# Altium schematic sheet Sheet1.SchDoc
size A3; SheetNumber: 1; SheetTotal: 1
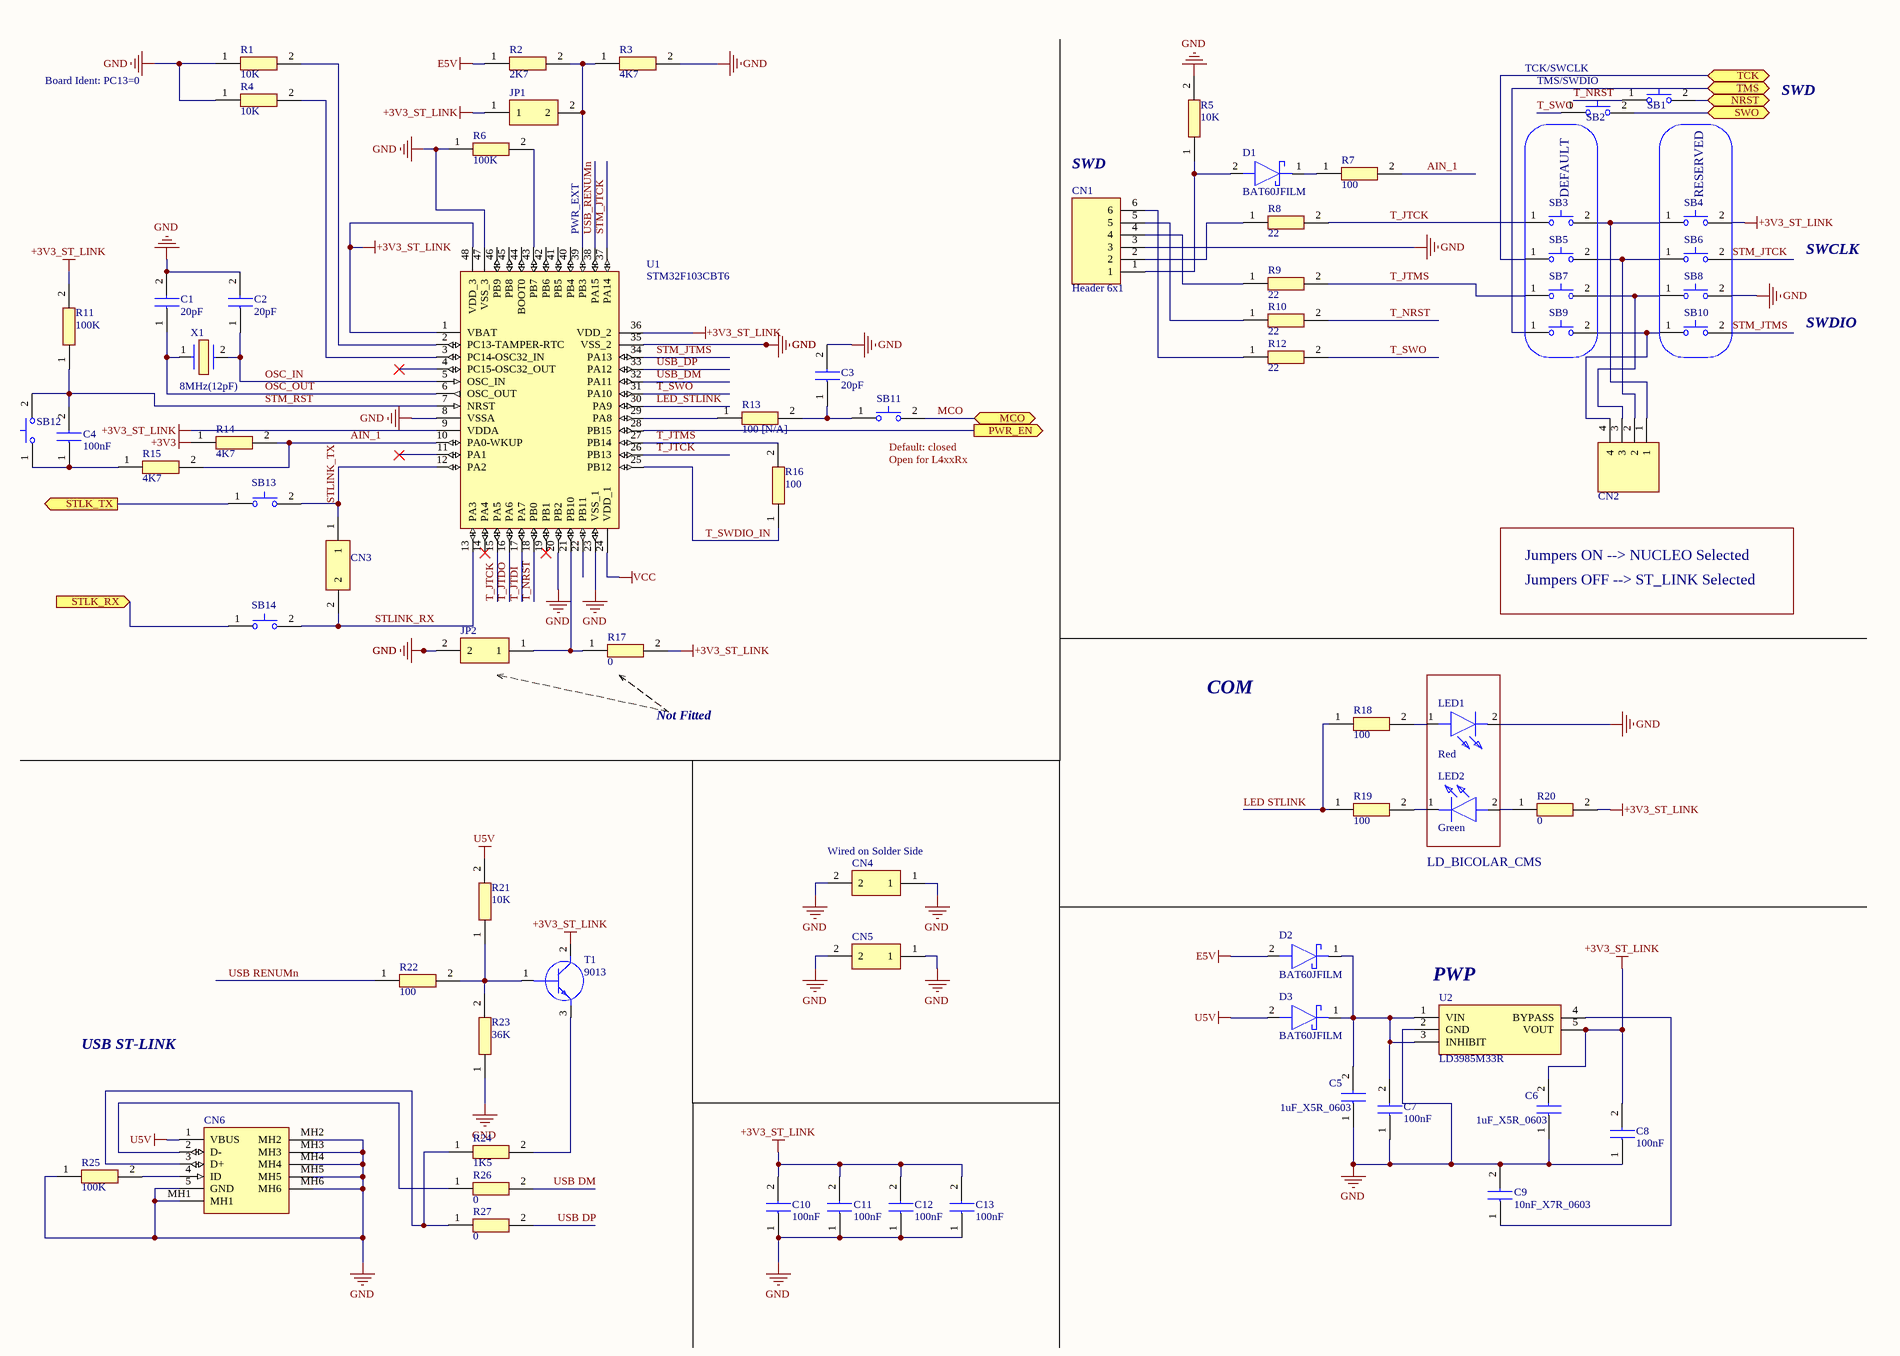
[diagram p0: Sheet1.SchDoc, right]

## Parts
C1  20pF  [C1206]
C2  20pF  [C1206]
C3  20pF  [C1206]
C4  100nF  [CAPC1608X90N]
C5  1uF_X5R_0603  [MAJx16]
C6  1uF_X5R_0603  [MAJx16]
C7  100nF  [CAPC1608X90N]
C8  100nF  [CAPC1608X90N]
C9  10nF_X7R_0603  [CAPC3316X145N]
C10  100nF  [CAPC1608X90N]
C11  100nF  [CAPC1608X90N]
C12  100nF  [CAPC1608X90N]
C13  100nF  [CAPC1608X90N]
CN1  Header 6x1  [HDRV6W66P0X254_1X6_1524X249X838P]
CN2  53014-0410  [SHDR4W60P0X200_1X4_1200X435X1000P]  (value not drawn)
CN3  3-647166-2  [36471662]  (value not drawn)
CN4  3-647166-2  [36471662]  (value not drawn)
CN5  3-647166-2  [36471662]  (value not drawn)
CN6  204926-1103  [2049261103]  (value not drawn)
D1  BAT60JFILM  [SOD2513X117N]
D2  BAT60JFILM  [SOD2513X117N]
D3  BAT60JFILM  [SOD2513X117N]
JP1  3-647166-2  [36471662]  (value not drawn)
JP2  3-647166-2  [36471662]  (value not drawn)
LED1  Red  [C4SMARGYCS4V1BB1]
LED2  Green  [TLHG5420ASZ]
R1  10K  [RESC6331X80N]
R2  2K7  [RESC3225X70N]
R3  4K7  [RESC1005X37N]
R4  10K  [RESC6331X80N]
R5  10K  [RESC6331X80N]
R6  100K  [RESC1005X40N]
R7  100  [RESC1005X37N]
R8  22  [ERA6AEB1020V]
R9  22  [ERA6AEB1020V]
R10  22  [ERA6AEB1020V]
R11  100K  [RESC1005X40N]
R12  22  [ERA6AEB1020V]
R13  100 [N/A]  [RESC1005X37N]
R14  4K7  [RESC1005X37N]
R15  4K7  [RESC1005X37N]
R16  100  [RESC1005X37N]
R17  0  [RESC2013X84N]
R18  100  [RESC1005X37N]
R19  100  [RESC1005X37N]
R20  0  [RESC2013X84N]
R21  10K  [RESC6331X80N]
R22  100  [RESC1005X37N]
R23  36K  [RESC2012X55N]
R24  1K5  [RESC3116X65N]
R25  100K  [RESC1005X40N]
R26  0  [RESC2013X84N]
R27  0  [RESC2013X84N]
SB1  8631CQD2  [8631CQD2]  (value not drawn)
SB2  8631CQD2  [8631CQD2]  (value not drawn)
SB3  8631CQD2  [8631CQD2]  (value not drawn)
SB4  8631CQD2  [8631CQD2]  (value not drawn)
SB5  8631CQD2  [8631CQD2]  (value not drawn)
SB6  8631CQD2  [8631CQD2]  (value not drawn)
SB7  8631CQD2  [8631CQD2]  (value not drawn)
SB8  8631CQD2  [8631CQD2]  (value not drawn)
SB9  8631CQD2  [8631CQD2]  (value not drawn)
SB10  8631CQD2  [8631CQD2]  (value not drawn)
SB11  8631CQD2  [8631CQD2]  (value not drawn)
SB12  8631CQD2  [8631CQD2]  (value not drawn)
SB13  8631CQD2  [8631CQD2]  (value not drawn)
SB14  8631CQD2  [8631CQD2]  (value not drawn)
T1  9013  [TO254P290X760X1320-3P]
U1  STM32F103CBT6  [QFP50P900X900X160-48N]
U2  LD3985M33R  [SOT95P280X145-5N]
X1  8MHz(12pF)  [ECS80125PXGMTR]

## Blocks framed on the sheet
DEFAULT: SB3 SB5 SB7 SB9
RESERVED: SB4 SB6 SB8 SB10

## Ports
MCO (bidir), NRST (bidir), PWR_EN (out), STLK_RX (in), STLK_TX (out), SWO (bidir), TCK (bidir), TMS (bidir)

## Nets
+3V3: R14.1
+3V3_ST_LINK: C6.2 C8.2 C10.2 C11.2 C12.2 C13.2 JP1.1 R11.2 R17.2 R20.2 SB4.2(N.O._2) T1.2(C) U1.1(VBAT) U1.9(VDDA) U1.36(VDD_2) U1.48(VDD_3) U2.5(VOUT)
E5V: D2.2(A) R2.1
GND: C1.2 C2.2 C3.2 C5.1 C6.1 C7.1 C8.1 C9.2 C10.1 C11.1 C12.1 C13.1 CN1.3 CN4.1 CN4.2 CN5.1 CN5.2 CN6.5(GND) CN6.MH1 CN6.MH2 CN6.MH3 CN6.MH4 CN6.MH5 CN6.MH6 JP2.2 LED1.2(K) R1.1 R3.2 R4.1 R5.2 R6.1 R23.1 R25.1 SB8.2(N.O._2) U1.8(VSSA) U1.20(PB2) U1.23(VSS_1) U1.35(VSS_2) U1.47(VSS_3) U2.2(GND)
U5V: CN6.1(VBUS) D3.2(A) R21.2
VCC: U1.24(VDD_1)
AIN_1: R7.2 R14.2 R15.2 U1.10(PA0-WKUP)
LED STLINK: R18.1 R19.1
LED_STLINK: U1.30(PA9)
MCO: SB11.2(N.O._2) ; port MCO
NRST: SB1.2(N.O._2) ; port NRST
OSC_IN: C2.1 U1.5(OSC_IN) X1.2
OSC_OUT: C1.1 U1.6(OSC_OUT) X1.1
PWR_EN: U1.28(PB15) ; port PWR_EN
STLINK_RX: CN3.2 SB14.2(N.O._2) U1.13(PA3)
STLINK_TX: CN3.1 SB13.2(N.O._2) U1.12(PA2)
STLK_RX: SB14.1(N.O._1) ; port STLK_RX
STLK_TX: SB13.1(N.O._1) ; port STLK_TX
STM_JTCK: SB6.2(N.O._2) U1.37(PA14)
STM_JTMS: SB10.2(N.O._2) U1.34(PA13)
STM_RST: C4.2 R11.1 SB12.2(N.O._2) U1.7(NRST)
SWO: SB2.2(N.O._2) ; port SWO
T_JTCK: R8.2 SB3.1(N.O._1) U1.15(PA5) U1.26(PB13)
T_JTDI: U1.17(PA7)
T_JTDO: U1.16(PA6)
T_JTMS: R9.2 R16.2 SB7.1(N.O._1) U1.27(PB14)
T_NRST: R10.2 SB1.1(N.O._1) U1.18(PB0)
T_SWDIO_IN: R16.1 U1.25(PB12)
T_SWO: R12.2 SB2.1(N.O._1) U1.31(PA10)
TCK: SB5.1(N.O._1) ; port TCK
TMS: SB9.1(N.O._1) ; port TMS
USB DM: R26.2
USB DP: R27.2
USB RENUMn: R22.1
USB_DM: U1.32(PA11)
USB_DP: U1.33(PA12)
USB_RENUMn: U1.38(PA15)
NetC3_1: C3.1 R13.2 SB11.1(N.O._1)
NetC4_1: C4.1 R15.1 SB12.1(N.O._1)
NetC5_2: C5.2 C7.2 D2.1(K) D3.1(K) U2.1(VIN) U2.3(INHIBIT)
NetC9_1: C9.1 U2.4(BYPASS)
NetCN1_1: CN1.1 D1.2(A) R5.1
NetCN1_2: CN1.2 R8.1
NetCN1_4: CN1.4 R9.1
NetCN1_5: CN1.5 R10.1
NetCN1_6: CN1.6 R12.1
NetCN2_1: CN2.1 SB3.2(N.O._2) SB4.1(N.O._1)
NetCN2_2: CN2.2 SB5.2(N.O._2) SB6.1(N.O._1)
NetCN2_3: CN2.3 SB7.2(N.O._2) SB8.1(N.O._1)
NetCN2_4: CN2.4 SB9.2(N.O._2) SB10.1(N.O._1)
NetCN6_2: CN6.2(D-) R26.1
NetCN6_3: CN6.3(D+) R24.1 R27.1
NetCN6_4: CN6.4(ID) R25.2
NetD1_1: D1.1(K) R7.1
NetJP1_2: JP1.2 R2.2 R3.1 U1.39(PB3)
NetJP2_1: JP2.1 R17.1 U1.21(PB10)
NetLED1_1: LED1.1(A) R18.2
NetLED2_1: LED2.1(K) R19.2
NetLED2_2: LED2.2(A) R20.1
NetR1_2: R1.2 U1.2(PC13-TAMPER-RTC)
NetR4_2: R4.2 U1.3(PC14-OSC32_IN)
NetR6_2: R6.2 U1.43(PB7)
NetR13_1: R13.1 U1.29(PA8)
NetR21_1: R21.1 R22.2 R23.2 T1.1(B)
NetR24_2: R24.2 T1.3(E)

Not connected (* = marked no-connect by the designer): U1 4(PC15-OSC32_OUT)* 11(PA1)* 14(PA4)* 19(PB1)* 22(PB11) 40(PB4) 41(PB5) 42(PB6) 44(BOOT0) 45(PB8) 46(PB9)

## Notes on the sheet
- Board Ident: PC13=0
- (near SB2) TCK/SWCLK
- (near SB2) TMS/SWDIO
- SWD
- (near CN1) SWD
- (near U1) PWR_EXT
- SWCLK
- SWDIO
- (near SB11) Default: closed
- (near SB11) Open for L4xxRx
- Jumpers ON --> NUCLEO Selected
- Jumpers OFF --> ST_LINK Selected
- Not Fitted
- COM
- (near CN4) Wired on Solder Side
- LD_BICOLAR_CMS
- (near U2) PWP
- USB ST-LINK

## Library data of the parts
C1-C3 = C1206C200KCGACTU: Capacitor; Manufacturer_Name: KEMET; Datasheet Link: https://content.kemet.com/datasheets/KEM_C1009_C0G_HV_SMD.pdf; Manufacturer_Part_Number: C1206C200KCGACTU
C4 C7 C8 C10-C13 = KAM15AR71H104KM: Capacitor; Manufacturer_Name: Kyocera AVX; Datasheet Link: https://datasheets.kyocera-avx.com/AutoMLCCKAM.pdf; Height: 0.9mm; Manufacturer_Part_Number: KAM15AR71H104KM; Mouser Part Number: 581-KAM15AR71H104KM; Mouser Price/Stock: https://www.mouser.co.uk/ProductDetail/KYOCERA-AVX/KAM15AR71H104KM?qs=Jm2GQyTW%2FbgzS5FHJWrFzQ%3D%3D; Arrow Part Number: KAM15AR71H104KM; Arrow Price/Stock: https://www.arrow.com/en/products/kam15ar71h104km/avx?region=nac
C5 C6 = MAJCT168BB7105KTEA01: Capacitor; Manufacturer_Name: TAIYO YUDEN; Datasheet Link: https://ds.yuden.co.jp/TYCOMPAS/or/detail?pn=MAJCT168BB7105KTEA01; Height: 0.8mm; Manufacturer_Part_Number: MAJCT168BB7105KTEA01
C9 = KGM31GCG2J103JU: Capacitor; Manufacturer_Name: Kyocera AVX; Datasheet Link: https://datasheets.kyocera-avx.com/HVKGM.pdf; Height: 1.45mm; Manufacturer_Part_Number: KGM31GCG2J103JU; Mouser Part Number: 581-KGM31GCG2J103JU; Mouser Price/Stock: https://www.mouser.co.uk/ProductDetail/KYOCERA-AVX/KGM31GCG2J103JU?qs=63Lh8XYXgjt6ivbLeGkCxg%3D%3D
CN1 = 22-28-4062: Connector; Manufacturer_Name: Molex; Datasheet Link: https://datasheet.datasheetarchive.com/originals/distributors/SFDatasheet-1/sf-00031037.pdf; Height: 8.38mm; Manufacturer_Part_Number: 22-28-4062; Mouser Part Number: 538-22-28-4062; Mouser Price/Stock: https://www.mouser.com/Search/Refine.aspx?Keyword=538-22-28-4062
CN2 = 53014-0410: Connector; Manufacturer_Name: Molex; Datasheet Link: https://www.molex.com/pdm_docs/sd/530140410_sd.pdf; Height: 10mm; Manufacturer_Part_Number: 53014-0410; Mouser Part Number: 538-53014-0410; Mouser Price/Stock: https://www.mouser.co.uk/ProductDetail/Molex/53014-0410?qs=TLs3Kb%252BkMqKk8s1WRHwRGw%3D%3D
CN3-CN5 JP1 JP2 = 3-647166-2: Connector; Manufacturer_Name: TE Connectivity; Datasheet Link: https://www.te.com/commerce/DocumentDelivery/DDEController?Action=showdoc&DocId=Customer+Drawing%7F647166%7FR1%7Fpdf%7FEnglish%7FENG_CD_647166_R1.pdf%7F3-647166-2; Height: 10.66mm; Manufacturer_Part_Number: 3-647166-2; Mouser Part Number: 571-3-647166-2; Mouser Price/Stock: https://www.mouser.co.uk/ProductDetail/TE-Connectivity/3-647166-2?qs=xsTFCgGnzbJU1qz6Np9kzA%3D%3D; Arrow Part Number: 3-647166-2; Arrow Price/Stock: https://www.arrow.com/en/products/3-647166-2/te-connectivity?region=nac
CN6 = 204926-1103: Connector; Manufacturer_Name: Molex; Datasheet Link: https://www.molex.com/content/dam/molex/molex-dot-com/products/automated/en-us/salesdrawingpdf/204/204926/2049261103_sd.pdf; Height: 4.65mm; Manufacturer_Part_Number: 204926-1103; Mouser Part Number: 538-204926-1103; Mouser Price/Stock: https://www.mouser.co.uk/ProductDetail/Molex/204926-1103?qs=55YtniHzbhBOQihiQOeiLg%3D%3D; Arrow Part Number: 204926-1103; Arrow Price/Stock: https://www.arrow.com/en/products/204926-1103/molex?region=nac
D1-D3 = BAT60JFILM: Schottky Diode; Manufacturer_Name: STMicroelectronics; Datasheet Link: https://www.mouser.jp/datasheet/2/389/cd00001944-1795661.pdf; Height: 1.17mm; Manufacturer_Part_Number: BAT60JFILM; Mouser Part Number: 511-BAT60JFILM; Mouser Price/Stock: https://www.mouser.co.uk/ProductDetail/STMicroelectronics/BAT60JFILM?qs=GnFZssByvVVVnMaukcyLZg%3D%3D; Arrow Part Number: BAT60JFILM; Arrow Price/Stock: https://www.arrow.com/en/products/bat60jfilm/stmicroelectronics?region=nac
LED1 = C4SMA-RGY-CS4V1BB1: LED; Manufacturer_Name: CREE LED; Datasheet Link: https://cree-led.com/media/documents/C4SMA-1442.pdf; Height: 8.8mm; Manufacturer_Part_Number: C4SMA-RGY-CS4V1BB1; Mouser Part Number: 941-C4SMARGYCS4V1BB1; Mouser Price/Stock: https://www.mouser.co.uk/ProductDetail/Cree-LED/C4SMA-RGY-CS4V1BB1?qs=7D1LtPJG0i08%2Fw1qRIcnyw%3D%3D; Arrow Part Number: C4SMA-RGY-CS4V1BB1; Arrow Price/Stock: https://www.arrow.com/en/products/c4sma-rgy-cs4v1bb1/cree-led?region=nac
LED2 = TLHG5420-ASZ: LED; Manufacturer_Name: Vishay; Datasheet Link: https://www.vishay.com/docs/86335/tlhg542_tlhg642.pdf; Height: 12.8mm; Manufacturer_Part_Number: TLHG5420-ASZ; Mouser Part Number: 78-TLHG5420-ASZ; Mouser Price/Stock: https://www.mouser.co.uk/ProductDetail/Vishay-Siliconix/TLHG5420-ASZ?qs=M%2FWrVUahkW9Iv5EBNpgqMA%3D%3D
R1 R4 R5 R21 = CRM2512QJW-103ELF: Resistor; Manufacturer_Name: Bourns; Datasheet Link: http://www.bourns.com/data/global/pdfs/CRM0805_1206_2010.pdf; Height: 0.8mm; Manufacturer_Part_Number: CRM2512QJW-103ELF; Mouser Part Number: 652-CRM2512QJW-103E; Mouser Price/Stock: https://www.mouser.co.uk/ProductDetail/Bourns/CRM2512QJW-103ELF?qs=8Wlm6%252BaMh8Rzg3bRHdWGsA%3D%3D; Arrow Part Number: CRM2512QJW-103ELF; Arrow Price/Stock: https://www.arrow.com/en/products/crm2512qjw-103elf/bourns?region=nac
R2 = CRCW12102K70FKEAHP: Resistor; Manufacturer_Name: Vishay; Datasheet Link: http://componentsearchengine.com/Datasheets/1/CRCW12102K70FKEAHP.pdf; Height: 0.7mm; Manufacturer_Part_Number: CRCW12102K70FKEAHP; Mouser Part Number: 71-CRCW12102K70FKEAH; Mouser Price/Stock: https://www.mouser.co.uk/ProductDetail/Vishay-Dale/CRCW12102K70FKEAHP?qs=OAzHGkhREL0m0%252BU1n6AaAg%3D%3D
R3 R14 R15 = MCS04020D4701BE000: Resistor; Manufacturer_Name: Vishay; Datasheet Link: http://www.vishay.com/docs/28705/mcx0x0xpro.pdf; Height: 0.37mm; Manufacturer_Part_Number: MCS04020D4701BE000; Mouser Part Number: 594-MCS04020D4701BE0; Mouser Price/Stock: https://www.mouser.co.uk/ProductDetail/Vishay-Beyschlag/MCS04020D4701BE000?qs=ft9OtscSA3%252BR0DpF5QqL2Q%3D%3D
R6 R11 R25 = SFR01MZPF1003: Resistor; Manufacturer_Name: ROHM Semiconductor; Datasheet Link: https://fscdn.rohm.com/en/products/databook/datasheet/passive/resistor/chip_resistor/sfr-e.pdf; Height: 0.4mm; Manufacturer_Part_Number: SFR01MZPF1003; Mouser Part Number: 755-SFR01MZPF1003; Mouser Price/Stock: https://www.mouser.co.uk/ProductDetail/ROHM-Semiconductor/SFR01MZPF1003?qs=Mv7BduZupUj2RFL5gMaKTg%3D%3D
R7 R13 R16 R18 R19 R22 = MCS04020C1000FE000: Resistor; Manufacturer_Name: Vishay; Datasheet Link: http://www.vishay.com/docs/28705/mcx0x0xpro.pdf; Height: 0.37mm; Manufacturer_Part_Number: MCS04020C1000FE000; Mouser Part Number: 594-MCS04020C1000FE0; Mouser Price/Stock: https://www.mouser.co.uk/ProductDetail/Vishay-Beyschlag/MCS04020C1000FE000?qs=7ZE6F4QMOBYkwvQlfbkT8w%3D%3D; Arrow Part Number: MCS04020C1000FE000; Arrow Price/Stock: https://www.arrow.com/en/products/mcs04020c1000fe000/vishay
R8-R10 R12 = ERA-6AHD220V: Resistor; Manufacturer_Name: Panasonic; Datasheet Link: https://industrial.panasonic.com/cdbs/www-data/pdf/RDM0000/AOA0000C307.pdf; Height: 0.6mm; Manufacturer_Part_Number: ERA-6AHD220V; Mouser Part Number: 667-ERA-6AHD220V; Mouser Price/Stock: https://www.mouser.co.uk/ProductDetail/Panasonic/ERA-6AHD220V/?qs=MNPzkKEzRtQTWqg2JSKn2A%3D%3D
R17 R20 R26 R27 = WSL080500000ZEA9: Resistor; Manufacturer_Name: Vishay; Datasheet Link: https://ad.componentsearchengine.com/Datasheets/2/WSL080500000ZEA9.pdf; Height: 0.838mm; Manufacturer_Part_Number: WSL080500000ZEA9; Mouser Part Number: 71-WSL080500000ZEA9; Mouser Price/Stock: https://www.mouser.co.uk/ProductDetail/Vishay-Dale/WSL080500000ZEA9?qs=f1l5vAGoKgsImKS87N8TmQ%3D%3D; Arrow Part Number: WSL080500000ZEA9; Arrow Price/Stock: https://www.arrow.com/en/products/wsl080500000zea9/vishay?region=nac
R23 = TNPW080536K0BEEA: Resistor; Manufacturer_Name: Vishay; Datasheet Link: https://www.vishay.com/docs/31006/tnpw.pdf; Height: 0.55mm; Manufacturer_Part_Number: TNPW080536K0BEEA
R24 = CRCW12061K50FKEAHP: Resistor; Manufacturer_Name: Vishay; Datasheet Link: http://componentsearchengine.com/Datasheets/1/CRCW12061K50FKEAHP.pdf; Height: 0.65mm; Manufacturer_Part_Number: CRCW12061K50FKEAHP; Mouser Part Number: 71-CRCW12061K50FKEAH; Mouser Price/Stock: https://www.mouser.co.uk/ProductDetail/Vishay-Dale/CRCW12061K50FKEAHP?qs=k2%2FDWSARqgEwHXAQbL4aEg%3D%3D; Arrow Part Number: CRCW12061K50FKEAHP; Arrow Price/Stock: https://www.arrow.com/en/products/crcw12061k50fkeahp/vishay?region=nac
SB1-SB14 = 8631CQD2: Switch (2-Pin Push); Manufacturer_Name: C & K COMPONENTS; Datasheet Link: https://www.ckswitches.com/media/1396/8600.pdf; Height: 13.93mm; Manufacturer_Part_Number: 8631CQD2; Mouser Part Number: 611-8631-261; Mouser Price/Stock: https://www.mouser.co.uk/ProductDetail/CK/8631CQD2?qs=ktcBc77oICXe9iPhfEwnkA%3D%3D
T1 = BD139: Transistor BJT NPN; Manufacturer_Name: STMicroelectronics; Datasheet Link: http://www.st.com/web/en/resource/technical/document/datasheet/CD00001225.pdf; Height: 2.9mm; Manufacturer_Part_Number: BD139; Mouser Part Number: 511-BD139; Mouser Price/Stock: https://www.mouser.co.uk/ProductDetail/STMicroelectronics/BD139?qs=ljbEvF4DwOPW%2FLxHSWYMMA%3D%3D; Arrow Part Number: BD139; Arrow Price/Stock: https://www.arrow.com/en/products/bd139/stmicroelectronics?region=europe
U1 = STM32F103CBT6: Integrated Circuit; Manufacturer_Name: STMicroelectronics; Datasheet Link: http://www.st.com/st-web-ui/static/active/en/resource/technical/document/datasheet/CD00161566.pdf; Height: 1.6mm; Manufacturer_Part_Number: STM32F103CBT6; Mouser Part Number: 511-STM32F103CBT6; Mouser Price/Stock: https://www.mouser.co.uk/ProductDetail/STMicroelectronics/STM32F103CBT6?qs=WxFF5lh7QM3goh6GV5Ogig%3D%3D; Arrow Part Number: STM32F103CBT6; Arrow Price/Stock: https://www.arrow.com/en/products/stm32f103cbt6/stmicroelectronics?region=europe
U2 = LD3985M33R: Integrated Circuit; Manufacturer_Name: STMicroelectronics; Datasheet Link: http://www.st.com/st-web-ui/static/active/en/resource/technical/document/datasheet/CD00003395.pdf; Height: 1.45mm; Manufacturer_Part_Number: LD3985M33R; Mouser Part Number: 511-LD3985M33R; Mouser Price/Stock: https://www.mouser.co.uk/ProductDetail/STMicroelectronics/LD3985M33R?qs=22WmWNTp1rrPOccVv4HZ7A%3D%3D; Arrow Part Number: LD3985M33R; Arrow Price/Stock: https://www.arrow.com/en/products/ld3985m33r/stmicroelectronics?region=europe
X1 = ECS-80-12-5PX-GM-TR: Crystal or Oscillator; Manufacturer_Name: ECS; Datasheet Link: https://ecsxtal.com/store/pdf/csm-7x.pdf; Height: 4.3mm; Manufacturer_Part_Number: ECS-80-12-5PX-GM-TR; Mouser Part Number: 520-80-12-5PX-GM-TR; Mouser Price/Stock: https://www.mouser.co.uk/ProductDetail/ECS/ECS-80-12-5PX-GM-TR?qs=amGC7iS6iy%252BwzUdIY7WpOA%3D%3D